# Altium project lm4550.PrjPcb
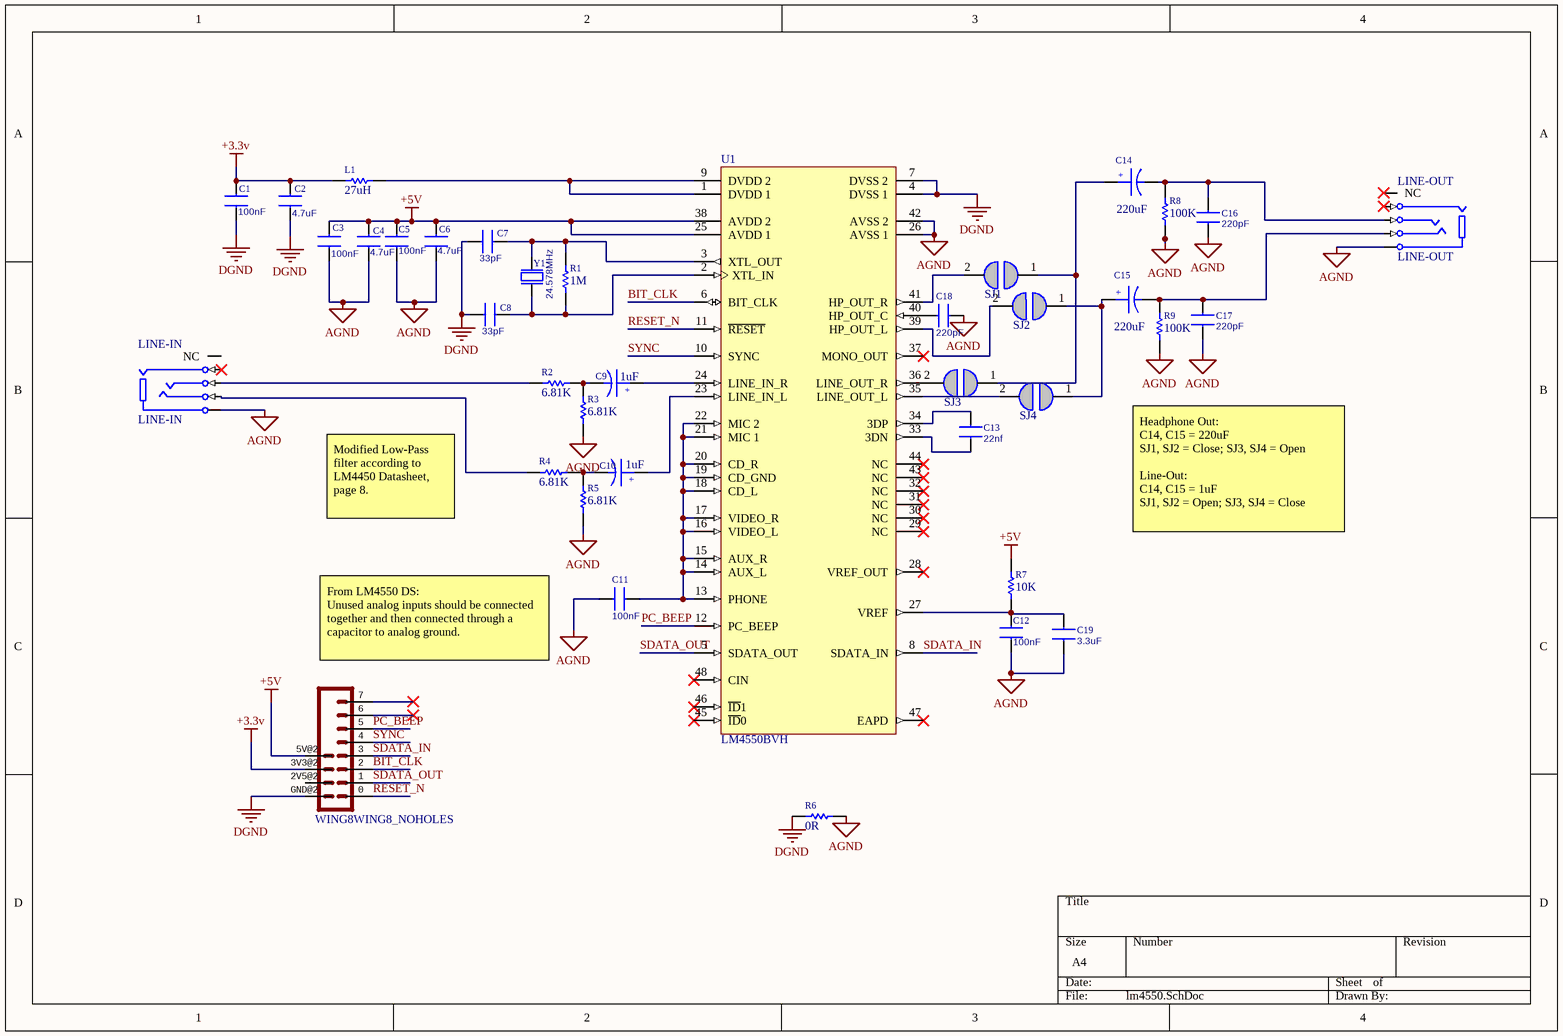
[diagram p0: lm4550.SchDoc]
1 sheet, 38 parts. Net scope: global (net labels, ports and power ports of the same name join across sheets).
Board file: lm4550.PcbDoc

## Sheet lm4550.SchDoc
size A4

### Parts
C1  100nF  [C0603]
C2  4.7uF  [C0805]
C3  100nF  [C0603]
C4  4.7uF  [C0805]
C5  100nF  [C0603]
C6  4.7uF  [C0805]
C7  33pF  [C0603]
C8  33pF  [C0603]
C9  1uF  [CPM3216]
C10  1uF  [CPM3216]
C11  100nF  [C0603]
C12  100nF  [C0603]
C13  22nf  [C0603]
C14  220uF  [CPM7343]
C15  220uF  [CPM7343]
C16  220pF  [C0805]
C17  220pF  [C0805]
C18  220pF  [C0805]
C19  3.3uF  [C0805]
L1  27uH  [R0805]
LINE-IN  LINE-IN  [PJ-386D]
LINE-OUT  LINE-OUT  [PJ-386D]
P1  WING8WING8_NOHOLES  [WINGSIDE_8BIT_NOHOLES]
R1  1M  [R0805]
R2  6.81K  [R0805]
R3  6.81K  [R0805]
R4  6.81K  [R0805]
R5  6.81K  [R0805]
R6  0R  [R0805]
R7  10K  [R0805]
R8  100K  [R0805]
R9  100K  [R0805]
SJ1  Solder Junction  [Solde Junction]  (value not drawn)
SJ2  Solder Junction  [Solde Junction]  (value not drawn)
SJ3  Solder Junction  [Solde Junction]  (value not drawn)
SJ4  Solder Junction  [Solde Junction]  (value not drawn)
U1  LM4550BVH  [VBH48A_N]
Y1  24.578MHz  [HC-49-S3]

### Nets
+3.3v: C1.2 C2.2 L1.2 P1.3V3@2(3V3)
+5V: C3.2 C4.2 C5.2 C6.2 P1.5V@2(5V) R7.2 U1.25(AVDD_1) U1.38(AVDD_2)
AGND: C3.1 C4.1 C5.1 C6.1 C11.2 C12.1 C16.1 C17.1 C18.1 C19.1 LINE-IN.1(S) LINE-OUT.1(S) R3.1 R5.1 R6.2 R8.1 R9.1 U1.26(AVSS_1) U1.42(AVSS_2)
DGND: C1.1 C2.1 C7.2 C8.2 P1.GND@2(GND) R6.1 U1.4(DVSS_1) U1.7(DVSS_2)
BIT_CLK: P1.2 U1.6(BIT_CLK)
PC_BEEP: P1.5 U1.12(PC_BEEP)
RESET_N: P1.0 U1.11(~{RESET})
SDATA_IN: P1.3 U1.8(SDATA_IN)
SDATA_OUT: P1.1 U1.5(SDATA_OUT)
SYNC: P1.4 U1.10(SYNC)
NetC7_1: C7.1 R1.2 U1.3(XTL_OUT) Y1.1
NetC8_1: C8.1 R1.1 U1.2(XTL_IN) Y1.2
NetC9_1: C9.1 U1.24(LINE_IN_R)
NetC9_2: C9.2 R2.2 R3.2
NetC10_1: C10.1 U1.23(LINE_IN_L)
NetC10_2: C10.2 R4.2 R5.2
NetC11_1: C11.1 U1.13(PHONE) U1.14(AUX_L) U1.15(AUX_R) U1.16(VIDEO_L) U1.17(VIDEO_R) U1.18(CD_L) U1.19(CD_GND) U1.20(CD_R) U1.21(MIC_1) U1.22(MIC_2)
NetC12_2: C12.2 C19.2 R7.1 U1.27(VREF)
NetC13_1: C13.1 U1.34(3DP)
NetC13_2: C13.2 U1.33(3DN)
NetC14_1: C14.1 SJ1.1 SJ3.1
NetC14_2: C14.2 C16.2 LINE-OUT.2(T) R8.2
NetC15_1: C15.1 SJ2.1 SJ4.1
NetC15_2: C15.2 C17.2 LINE-OUT.3(R) R9.2
NetC18_2: C18.2 U1.40(HP_OUT_C)
NetL1_1: L1.1 U1.1(DVDD_1) U1.9(DVDD_2)
NetLINE-IN_2: LINE-IN.2(T) R2.1
NetLINE-IN_3: LINE-IN.3(R) R4.1
NetSJ1_2: SJ1.2 U1.41(HP_OUT_R)
NetSJ2_2: SJ2.2 U1.39(HP_OUT_L)
NetSJ3_2: SJ3.2 U1.36(LINE_OUT_R)
NetSJ4_2: SJ4.2 U1.35(LINE_OUT_L)

Not connected (* = marked no-connect by the designer): LINE-IN 4(SN)* 10(NC); LINE-OUT 4(SN)* 10(NC)*; P1 2V5@2(2V5) 6(7)* 7(8)*; U1 28(VREF_OUT)* 29(NC)* 30(NC)* 31(NC)* 32(NC)* 37(MONO_OUT)* 43(NC)* 44(NC)* 45(~{ID}0)* 46(~{ID}1)* 47(EAPD)* 48(CIN)*

### Notes on the sheet
- Modified Low-Pass filter according to LM4450 Datasheet, page 8.
- Headphone Out:
  C14, C15 = 220uF
  SJ1, SJ2 = Close; SJ3, SJ4 = Open
  Line-Out:
  C14, C15 = 1uF
  SJ1, SJ2 = Open; SJ3, SJ4 = Close
- From LM4550 DS:
  Unused analog inputs should be connected together and then connected through a capacitor to analog ground.
- (in symbol CPM3216) +
- (in symbol CPM7343) +

### Library data of the parts
C1 C3 C5 C7 C8 C11-C13 = C0603: Ceramic Capactor size 0603; Supplier: *
  C1 C3 C5 C11 C12: Value: 100nF
  C7 C8: Value: 33pF
  C13: Value: 22nf
C2 C4 C6 C16-C19 = C0805: Ceramic Capactor size 0805; Supplier: *
  C2 C4 C6: Value: 4.7uF
  C16-C18: Value: 220pF
  C19: Value: 3.3uF
C9 C10 = CPM3216: Tantalium Capacitor size A (3216 Metric); Value: 1uF
C14 C15 = CPM7343: Tantalium Capacitor size D (7343 Metric); Value: 220uF
L1 = R0805: SMD Chip Inductor size 0805; Value: 27uH
LINE-IN LINE-OUT = TSH-3864D: Phone Jack, PJ-386D Series, Right Angle, SM, 4-Conductor Open Circuit; PCB_Layout: Complies with manufacturer's recommendation.; DrillSize: Corresponds to nominal value.; Published: 30-May-2008; DatasheetVersion: revA, 2006; PackageVersion: revA, 2006; PackageReference: PJ-386D; Publisher: Altium Limited; PackageDescription: PJ-386D Series Phone Jack, Right Angle, SM, Body 14 x 6 x 4.8 mm (LxWxH); ComponentLink1Description: Manufacturer Link; ComponentLink1URL: http://www.contactswitch.com/; ComponentLink2Description: Datasheet; ComponentLink2URL: http://www.contactswitch.com/uploads/product/pdf_file_193.pdf
R1-R9 = R0805: Chip Resistor size 0805
  R1: Value: 1M
  R2-R5: Value: 6.81K
  R6: Value: 0R
  R7: Value: 10K
  R8 R9: Value: 100K
U1 = LM4550BVH: AC '97 Rev 2.1 Codec with Sample Rate Conversion and National 3D Sound, 48-pin LQFP; Manufacturer: National Semiconductor; PackageTopMarking: NSUZXYTT*LM4550*BVH; PowerWise: N; CompType: OtherParts; Published: 4-Dec-2008; DatasheetVersion: Sep-2006; PackageVersion: revE, May-2007; PackageReference: VBH48A; Publisher: Altium Limited; PackageDescription: LQFP, 7 x 7 x 1.4mm, 48 Lead, 0.5mm Pitch; PartNumber: LM4550BVH; RoHS: N; PinCount: 48; ComponentLink1Description: LM4550B Datasheet; ComponentLink1URL: http://www.national.com/ds/LM/LM4550B.pdf; ComponentLink2Description: LM4550B Web Page; ComponentLink2URL: http://www.national.com/pf/LM/LM4550B.html; ComponentLink3Description: VBH48A Package Page; ComponentLink3URL: http://www.national.com/packaging/folders/vbh48a.html
Y1 = XTAL_TH: XTAL Trough Hole; Value: 24.578MHz